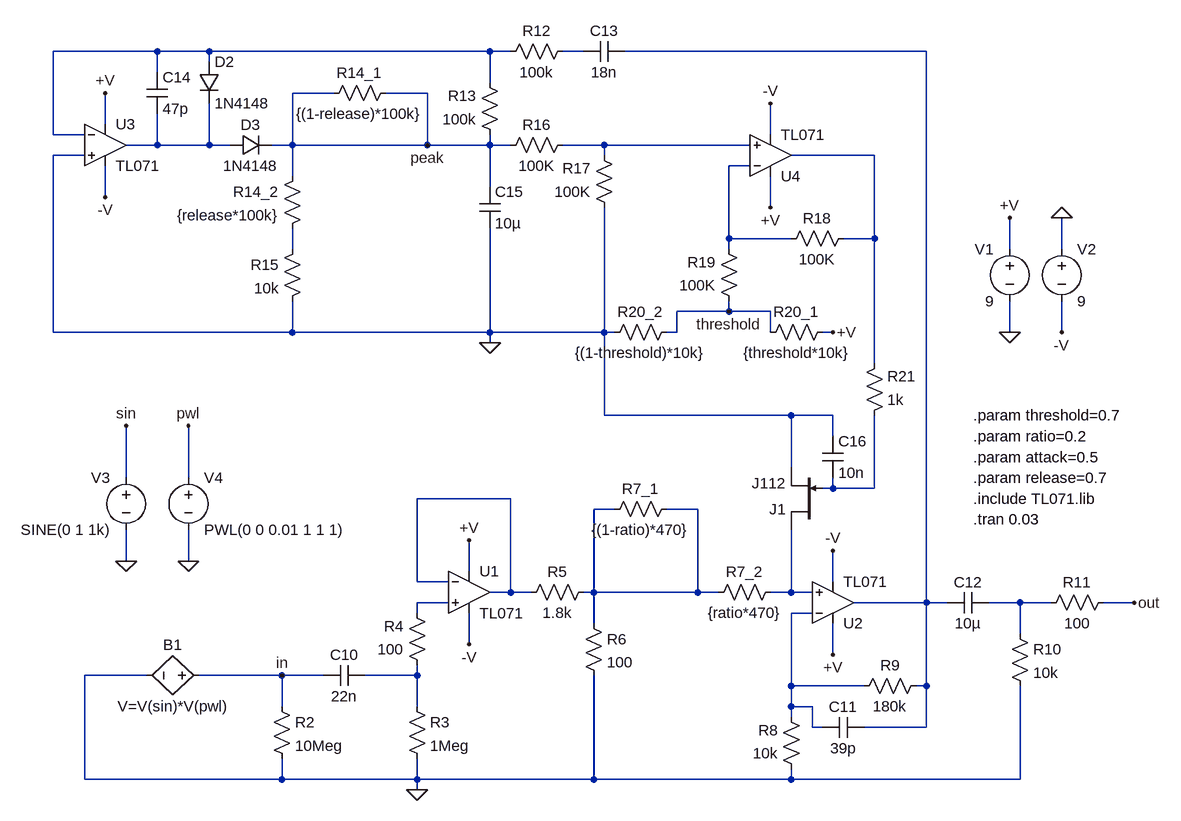
[diagram p0: schematic compressor_simulation.asc]
compressor_simulation.asc, the LTspice schematic file:
Version 4.1
SHEET 1 3996 1472
WIRE 1808 -736 1648 -736
WIRE 1888 -736 1808 -736
WIRE 2320 -736 1888 -736
WIRE 2352 -736 2320 -736
WIRE 2464 -736 2432 -736
WIRE 2992 -736 2528 -736
WIRE 1888 -720 1888 -736
WIRE 1808 -704 1808 -736
WIRE 2320 -688 2320 -736
WIRE 2080 -672 2016 -672
WIRE 2224 -672 2160 -672
WIRE 1728 -624 1728 -672
WIRE 1648 -608 1648 -736
WIRE 1696 -608 1648 -608
WIRE 2752 -608 2752 -656
WIRE 1808 -592 1808 -640
WIRE 1808 -592 1760 -592
WIRE 1888 -592 1888 -656
WIRE 1888 -592 1808 -592
WIRE 1920 -592 1888 -592
WIRE 2016 -592 2016 -672
WIRE 2016 -592 1984 -592
WIRE 2224 -592 2224 -672
WIRE 2224 -592 2016 -592
WIRE 2320 -592 2320 -608
WIRE 2320 -592 2224 -592
WIRE 2352 -592 2320 -592
WIRE 2496 -592 2432 -592
WIRE 2720 -592 2496 -592
WIRE 1696 -576 1648 -576
WIRE 2496 -576 2496 -592
WIRE 2912 -576 2784 -576
WIRE 2720 -560 2688 -560
WIRE 2016 -544 2016 -592
WIRE 2320 -528 2320 -592
WIRE 1728 -512 1728 -560
WIRE 2752 -496 2752 -544
WIRE 2688 -448 2688 -560
WIRE 2784 -448 2688 -448
WIRE 2912 -448 2912 -576
WIRE 2912 -448 2864 -448
WIRE 2016 -432 2016 -464
WIRE 2688 -432 2688 -448
WIRE 3120 -432 3120 -480
WIRE 3200 -432 3200 -480
WIRE 2688 -336 2688 -352
WIRE 2688 -336 2608 -336
WIRE 2752 -336 2688 -336
WIRE 1648 -304 1648 -576
WIRE 2016 -304 2016 -352
WIRE 2016 -304 1648 -304
WIRE 2320 -304 2320 -464
WIRE 2320 -304 2016 -304
WIRE 2496 -304 2496 -496
WIRE 2496 -304 2320 -304
WIRE 2512 -304 2496 -304
WIRE 2608 -304 2608 -336
WIRE 2608 -304 2592 -304
WIRE 2752 -304 2752 -336
WIRE 2848 -304 2832 -304
WIRE 3120 -304 3120 -352
WIRE 3200 -304 3200 -352
WIRE 2320 -288 2320 -304
WIRE 2912 -256 2912 -448
WIRE 2496 -176 2496 -304
WIRE 2784 -176 2496 -176
WIRE 2848 -176 2784 -176
WIRE 2848 -144 2848 -176
WIRE 2784 -96 2784 -176
WIRE 1760 -80 1760 -160
WIRE 1856 -80 1856 -160
WIRE 2848 -64 2848 -80
WIRE 2848 -64 2832 -64
WIRE 2912 -64 2912 -176
WIRE 2912 -64 2848 -64
WIRE 2352 -48 2208 -48
WIRE 2512 -32 2480 -32
WIRE 2640 -32 2592 -32
WIRE 1760 48 1760 0
WIRE 1856 48 1856 0
WIRE 2288 64 2288 16
WIRE 2208 80 2208 -48
WIRE 2256 80 2208 80
WIRE 2848 80 2848 32
WIRE 2352 96 2352 -48
WIRE 2352 96 2320 96
WIRE 2384 96 2352 96
WIRE 2480 96 2480 -32
WIRE 2480 96 2464 96
WIRE 2640 96 2640 -32
WIRE 2640 96 2480 96
WIRE 2672 96 2640 96
WIRE 2784 96 2784 0
WIRE 2784 96 2752 96
WIRE 2816 96 2784 96
WIRE 2256 112 2208 112
WIRE 2992 112 2992 -736
WIRE 2992 112 2880 112
WIRE 3024 112 2992 112
WIRE 3136 112 3088 112
WIRE 3184 112 3136 112
WIRE 3312 112 3264 112
WIRE 2208 128 2208 112
WIRE 2816 128 2784 128
WIRE 2480 144 2480 96
WIRE 3136 160 3136 112
WIRE 2288 176 2288 128
WIRE 2848 192 2848 144
WIRE 1792 224 1696 224
WIRE 2000 224 1872 224
WIRE 2064 224 2000 224
WIRE 2208 224 2208 208
WIRE 2208 224 2128 224
WIRE 2784 240 2784 128
WIRE 2896 240 2784 240
WIRE 2992 240 2992 112
WIRE 2992 240 2976 240
WIRE 2000 272 2000 224
WIRE 2208 272 2208 224
WIRE 2784 272 2784 240
WIRE 2816 272 2784 272
WIRE 2784 288 2784 272
WIRE 2816 304 2816 272
WIRE 2832 304 2816 304
WIRE 2992 304 2992 240
WIRE 2992 304 2896 304
WIRE 1696 384 1696 224
WIRE 2000 384 2000 352
WIRE 2000 384 1696 384
WIRE 2208 384 2208 352
WIRE 2208 384 2000 384
WIRE 2480 384 2480 224
WIRE 2480 384 2208 384
WIRE 2784 384 2784 368
WIRE 2784 384 2480 384
WIRE 3136 384 3136 240
WIRE 3136 384 2784 384
WIRE 2208 400 2208 384
FLAG 3120 -304 0
FLAG 3120 -480 +V
FLAG 3200 -480 0
FLAG 3200 -304 -V
FLAG 2000 224 in
FLAG 2288 16 +V
FLAG 2288 176 -V
FLAG 2848 192 +V
FLAG 2848 32 -V
FLAG 2224 -592 peak
FLAG 2752 -496 +V
FLAG 2752 -656 -V
FLAG 2848 -304 +V
FLAG 2688 -336 threshold
FLAG 1728 -672 +V
FLAG 1728 -512 -V
FLAG 1760 48 0
FLAG 1856 48 0
FLAG 1760 -160 sin
FLAG 1856 -160 pwl
FLAG 2208 400 0
FLAG 3312 112 out
FLAG 2320 -288 0
SYMBOL voltage 3120 -448 M0
WINDOW 123 0 0 Left 0
WINDOW 39 0 0 Left 0
SYMATTR InstName V1
SYMATTR Value 9
SYMBOL voltage 3200 -448 R0
WINDOW 123 0 0 Left 0
WINDOW 39 0 0 Left 0
SYMATTR InstName V2
SYMATTR Value 9
SYMBOL OpAmps\\opamp2 2288 32 R0
SYMATTR InstName U1
SYMATTR Value TL071
SYMBOL res 2464 128 R0
SYMATTR InstName R6
SYMATTR Value 100
SYMBOL res 2480 80 R90
WINDOW 0 0 56 VBottom 2
WINDOW 3 32 56 VTop 2
SYMATTR InstName R5
SYMATTR Value 1.8k
SYMBOL OpAmps\\opamp2 2848 176 M180
SYMATTR InstName U2
SYMATTR Value TL071
SYMBOL res 2992 224 R90
WINDOW 0 0 56 VBottom 2
WINDOW 3 32 56 VTop 2
SYMATTR InstName R9
SYMATTR Value 180k
SYMBOL res 2800 384 R180
WINDOW 0 36 76 Left 2
WINDOW 3 36 40 Left 2
SYMATTR InstName R8
SYMATTR Value 10k
SYMBOL njf 2832 0 R180
SYMATTR InstName J1
SYMATTR Value J112
SYMBOL cap 2304 -528 R0
SYMATTR InstName C15
SYMATTR Value 10µ
SYMBOL res 2032 -560 M0
SYMATTR InstName R14_2
SYMATTR Value {release*100k}
SYMBOL res 2176 -688 R90
WINDOW 0 0 56 VBottom 2
WINDOW 3 32 56 VTop 2
SYMATTR InstName R14_1
SYMATTR Value {(1-release)*100k}
SYMBOL OpAmps\\opamp2 2752 -512 M180
SYMATTR InstName U4
SYMATTR Value TL071
SYMBOL res 2768 80 R90
WINDOW 0 0 56 VBottom 2
WINDOW 3 32 56 VTop 2
SYMATTR InstName R7_2
SYMATTR Value {ratio*470}
SYMBOL res 2880 -464 R90
WINDOW 0 0 56 VBottom 2
WINDOW 3 32 56 VTop 2
SYMATTR InstName R18
SYMATTR Value 100K
SYMBOL res 2704 -336 R180
WINDOW 0 36 76 Left 2
WINDOW 3 36 40 Left 2
SYMATTR InstName R19
SYMATTR Value 100K
SYMBOL res 2448 -608 R90
WINDOW 0 0 56 VBottom 2
WINDOW 3 32 56 VTop 2
SYMATTR InstName R16
SYMATTR Value 100K
SYMBOL res 2512 -480 R180
WINDOW 0 36 76 Left 2
WINDOW 3 36 40 Left 2
SYMATTR InstName R17
SYMATTR Value 100K
SYMBOL res 2608 -320 R90
WINDOW 0 0 56 VBottom 2
WINDOW 3 32 56 VTop 2
SYMATTR InstName R20_2
SYMATTR Value {(1-threshold)*10k}
SYMBOL res 2848 -320 R90
WINDOW 0 0 56 VBottom 2
WINDOW 3 32 56 VTop 2
SYMATTR InstName R20_1
SYMATTR Value {threshold*10k}
SYMBOL OpAmps\\opamp2 1728 -656 R0
SYMATTR InstName U3
SYMATTR Value TL071
SYMBOL diode 1872 -720 R0
SYMATTR InstName D2
SYMATTR Value 1N4148
SYMBOL diode 1920 -576 R270
WINDOW 0 32 32 VTop 2
WINDOW 3 0 32 VBottom 2
SYMATTR InstName D3
SYMATTR Value 1N4148
SYMBOL res 2336 -592 R180
WINDOW 0 36 76 Left 2
WINDOW 3 36 40 Left 2
SYMATTR InstName R13
SYMATTR Value 100k
SYMBOL res 2608 -48 R90
WINDOW 0 0 56 VBottom 2
WINDOW 3 32 56 VTop 2
SYMATTR InstName R7_1
SYMATTR Value {(1-ratio)*470}
SYMBOL res 2032 -448 M0
SYMATTR InstName R15
SYMATTR Value 10k
SYMBOL cap 2528 -752 R90
WINDOW 0 0 32 VBottom 2
WINDOW 3 32 32 VTop 2
SYMATTR InstName C13
SYMATTR Value 18n
SYMBOL voltage 1760 -96 M0
WINDOW 123 0 0 Left 0
WINDOW 39 0 0 Left 0
SYMATTR InstName V3
SYMATTR Value SINE(0 1 1k)
SYMBOL voltage 1856 -96 R0
WINDOW 123 0 0 Left 0
WINDOW 39 0 0 Left 0
SYMATTR InstName V4
SYMATTR Value PWL(0 0 0.01 1 1 1)
SYMBOL bv 1888 224 R90
WINDOW 0 -32 56 VBottom 2
WINDOW 3 32 56 VTop 2
SYMATTR InstName B1
SYMATTR Value V=V(sin)*V(pwl)
SYMBOL res 2448 -752 R90
WINDOW 0 0 56 VBottom 2
WINDOW 3 32 56 VTop 2
SYMATTR InstName R12
SYMATTR Value 100k
SYMBOL cap 2896 288 R90
WINDOW 0 0 32 VBottom 2
WINDOW 3 32 32 VTop 2
SYMATTR InstName C11
SYMATTR Value 39p
SYMBOL res 1984 256 R0
SYMATTR InstName R2
SYMATTR Value 10Meg
SYMBOL cap 2128 208 R90
WINDOW 0 0 32 VBottom 2
WINDOW 3 32 32 VTop 2
SYMATTR InstName C10
SYMATTR Value 22n
SYMBOL res 2192 256 R0
SYMATTR InstName R3
SYMATTR Value 1Meg
SYMBOL res 2224 224 R180
WINDOW 0 36 76 Left 2
WINDOW 3 36 40 Left 2
SYMATTR InstName R4
SYMATTR Value 100
SYMBOL cap 3088 96 R90
WINDOW 0 0 32 VBottom 2
WINDOW 3 32 32 VTop 2
SYMATTR InstName C12
SYMATTR Value 10µ
SYMBOL res 3120 144 R0
SYMATTR InstName R10
SYMATTR Value 10k
SYMBOL res 3280 96 R90
WINDOW 0 0 56 VBottom 2
WINDOW 3 32 56 VTop 2
SYMATTR InstName R11
SYMATTR Value 100
SYMBOL cap 1792 -640 M180
WINDOW 0 24 56 Left 2
WINDOW 3 24 8 Left 2
SYMATTR InstName C14
SYMATTR Value 47p
SYMBOL res 2896 -160 M180
WINDOW 0 36 76 Left 2
WINDOW 3 36 40 Left 2
SYMATTR InstName R21
SYMATTR Value 1k
SYMBOL cap 2832 -80 M180
WINDOW 0 24 56 Left 2
WINDOW 3 24 8 Left 2
SYMATTR InstName C16
SYMATTR Value 10n
TEXT 3064 -48 Left 2 !.include TL071.lib
TEXT 3064 -80 Left 2 !.param release=0.7
TEXT 3064 -112 Left 2 !.param attack=0.5
TEXT 3064 -144 Left 2 !.param ratio=0.2
TEXT 3064 -176 Left 2 !.param threshold=0.7
TEXT 3064 -16 Left 2 !.tran 0.03

The netlist it stands for:
* compressor_simulation.asc
V1 +V 0 9
V2 0 -V 9
X§U1 N013 N010 +V -V N010 TL071  ; pins In+ In- V+ V- OUT
R6 N011 0 100
R5 N011 N010 1.8k
X§U2 N012 N015 +V -V N003 TL071  ; pins In+ In- V+ V- OUT
R9 N003 N015 180k
R8 0 N015 10k
J1 N012 N009 0 J112
C15 peak 0 10µ
R14_2 peak N008 {release*100k}
R14_1 peak peak {(1-release)*100k}
X§U4 N005 N007 +V -V N006 TL071  ; pins In+ In- V+ V- OUT
R7_2 N012 N011 {ratio*470}
R18 N006 N007 100K
R19 threshold N007 100K
R16 N005 peak 100K
R17 0 N005 100K
R20_2 threshold 0 {(1-threshold)*10k}
R20_1 +V threshold {threshold*10k}
X§U3 0 N001 +V -V N004 TL071  ; pins In+ In- V+ V- OUT
D2 N001 N004 1N4148
D3 N004 peak 1N4148
R13 peak N001 100k
R7_1 N011 N011 {(1-ratio)*470}
R15 N008 0 10k
C13 N003 N002 18n
V3 sin 0 SINE(0 1 1k)
V4 pwl 0 PWL(0 0 0.01 1 1 1)
B1 in 0 V=V(sin)*V(pwl)
R12 N002 N001 100k
C11 N003 N015 39p
R2 in 0 10Meg
C10 N016 in 22n
R3 N016 0 1Meg
R4 N016 N013 100
C12 N014 N003 10µ
R10 N014 0 10k
R11 out N014 100
C14 N004 N001 47p
R21 N009 N006 1k
C16 N009 0 10n
.model D D
.lib standard.dio
.model NJF NJF
.model PJF PJF
.lib standard.jft
.include TL071.lib
.param release=0.7
.param attack=0.5
.param ratio=0.2
.param threshold=0.7
.tran 0.03
.backanno
.end